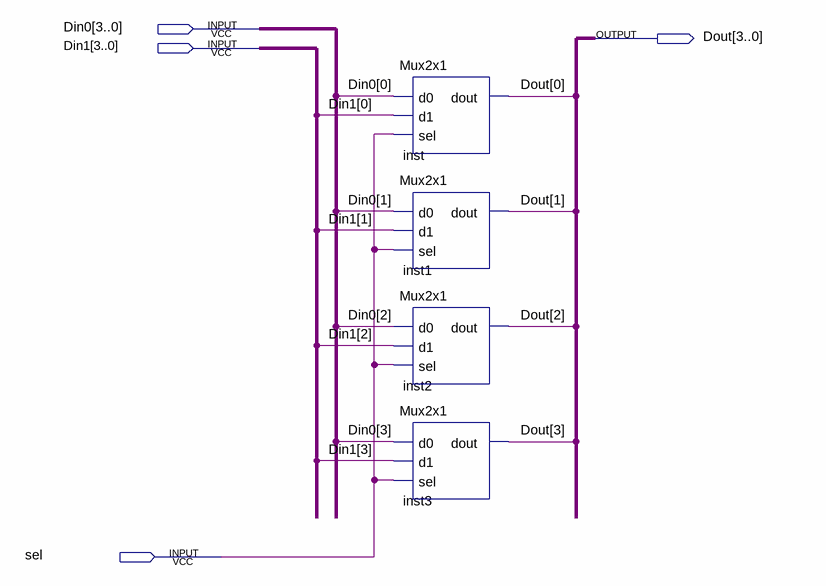
[diagram p0: schematic sheet]
// Quartus schematic Mux4bit2x1.bdf as structural Verilog: 4 symbols, 4 pins
module Mux4bit2x1 (
  input  [3:0] Din0,
  input  [3:0] Din1,
  input  sel,
  output [3:0] Dout
);

  Mux2x1 inst (.d0(Din0[0]), .d1(Din1[0]), .sel(sel), .dout(Dout[0]));
  Mux2x1 inst1 (.d0(Din0[1]), .d1(Din1[1]), .sel(sel), .dout(Dout[1]));
  Mux2x1 inst2 (.d0(Din0[2]), .d1(Din1[2]), .sel(sel), .dout(Dout[2]));
  Mux2x1 inst3 (.d0(Din0[3]), .d1(Din1[3]), .sel(sel), .dout(Dout[3]));
endmodule
